# Altium project EMG_TA.PrjPcb
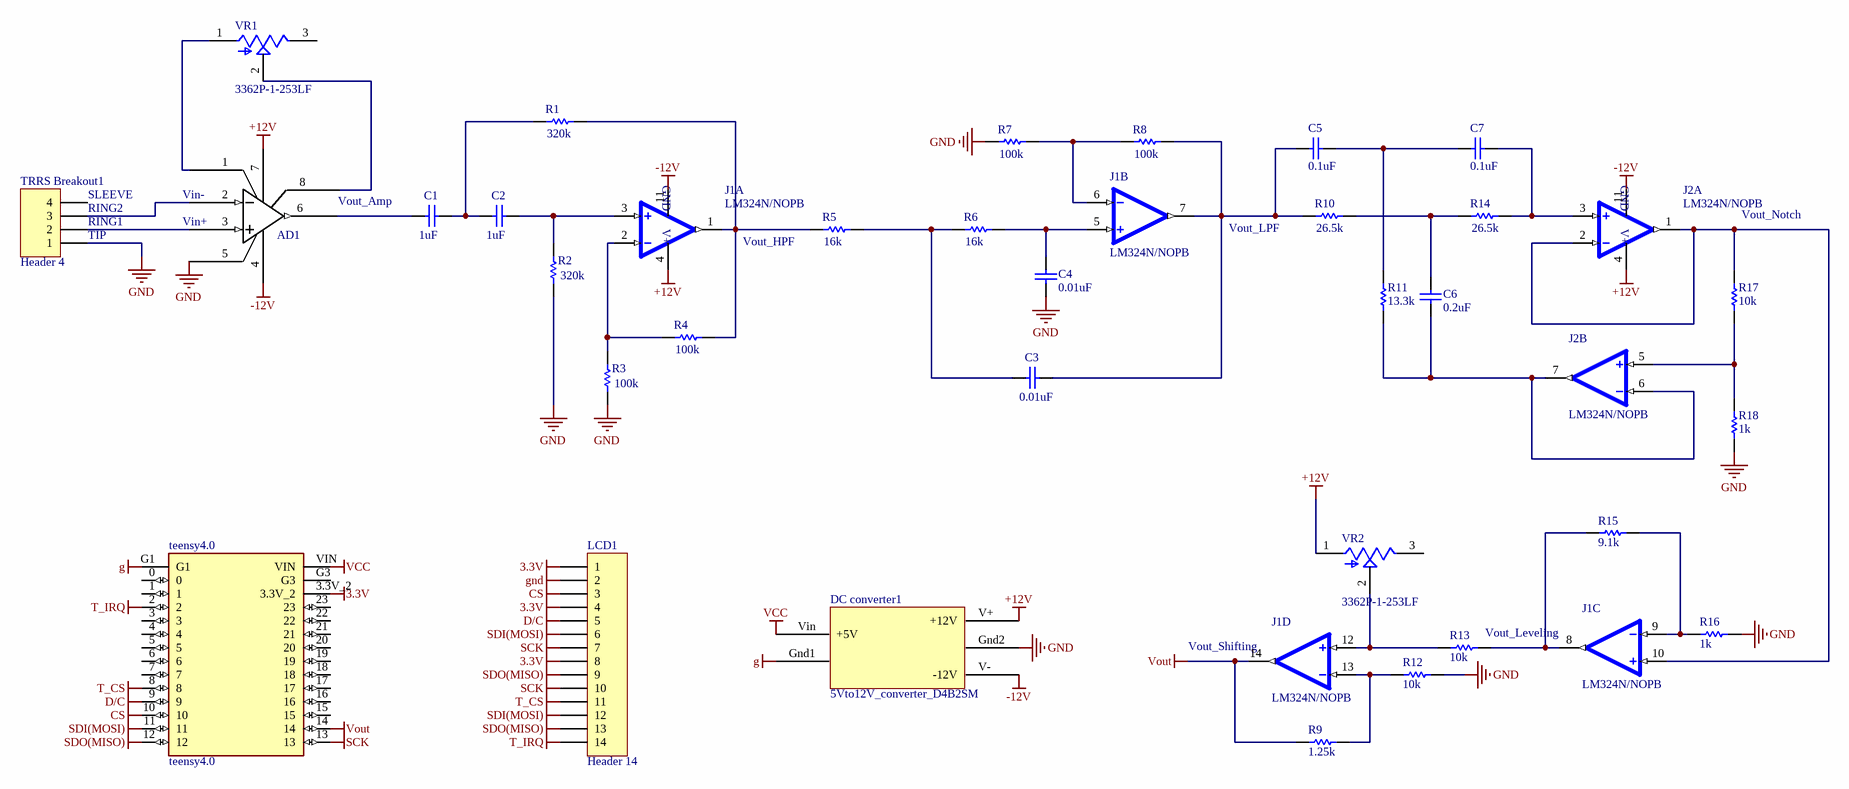
[diagram p0: EMG-circuit_v2.SchDoc]
2 sheets, 73 parts. Net scope: global (net labels, ports and power ports of the same name join across sheets).
Board file: EMG-circuit_v2.PcbDoc
Sheets:
  EMG-circuit_v2.SchDoc
  EMG-circuit.SchDoc

## Sheet EMG-circuit_v2.SchDoc
size A3; SheetNumber: 1; SheetTotal: 1; SPICEModelCacheHVKWMQRZ: <root> / <DocumentId>HVKWMQRZ</DocumentId> / <CacheFrame Number="0"> / <Model Name="cap" Kind="MDL"> / <Text>*Default semiconductor capacitor / .MODEL CAP C()</Text> / </Model> / </CacheFrame> / </root>

### Parts
(Parts that share a designator on the sheet are numbered #1, #2 ... from top to bottom, then left to right.)
AD1#1  [Instrumentation amplifier]8pin-DIP-10.92*7.11  [AD620AN-8pin-10.92*7.11]  (value not drawn)
C1#1  value 1uF  [RAD-0.3]  (hidden comment: Cap)
C2#1  value 1uF  [RAD-0.3]  (hidden comment: Cap)
C3#1  value 0.01uF  [RAD-0.3]  (hidden comment: Cap)
C4#1  value 0.01uF  [RAD-0.3]  (hidden comment: Cap)
C5#1  value 0.1uF  [RAD-0.3]  (hidden comment: Cap)
C6#1  value 0.2uF  [RAD-0.3]  (hidden comment: Cap)
C7#1  value 0.1uF  [RAD-0.3]  (hidden comment: Cap)
DC_converter1  5Vto12V_converter_D4B2SM  [5Vto12V_converter-5pin-24*12.4]
J1  LM324N/NOPB  [DIP825W47P254L1917H533Q14]  (parts A,B,C,D of 4)
J2  LM324N/NOPB  [DIP825W47P254L1917H533Q14]  (parts A,B of 4)
LCD1  Header 14  [HDR1X14]
R1#1  value 320k  [AXIAL-0.3]  (hidden comment: Res1)
R2#1  value 320k  [AXIAL-0.3]  (hidden comment: Res1)
R3#1  value 100k  [AXIAL-0.3]  (hidden comment: Res1)
R4#1  value 100k  [AXIAL-0.3]  (hidden comment: Res1)
R5#1  value 16k  [AXIAL-0.3]  (hidden comment: Res1)
R6#1  value 16k  [AXIAL-0.3]  (hidden comment: Res1)
R7#1  value 100k  [AXIAL-0.3]  (hidden comment: Res1)
R8#1  value 100k  [AXIAL-0.3]  (hidden comment: Res1)
R9#1  value 1.25k  [AXIAL-0.3]  (hidden comment: Res1)
R10#1  value 26.5k  [AXIAL-0.3]  (hidden comment: Res1)
R11#1  value 13.3k  [AXIAL-0.3]  (hidden comment: Res1)
R12#1  value 10k  [AXIAL-0.3]  (hidden comment: Res1)
R13#1  value 10k  [AXIAL-0.3]  (hidden comment: Res1)
R14#1  value 26.5k  [AXIAL-0.3]  (hidden comment: Res1)
R15#1  value 9.1k  [AXIAL-0.3]  (hidden comment: Res1)
R16#1  value 1k  [AXIAL-0.3]  (hidden comment: Res1)
R17#1  value 10k  [AXIAL-0.3]  (hidden comment: Res1)
R18  value 1k  [AXIAL-0.3]  (hidden comment: Res1)
teensy4.0  teensy4.0  [teensy4.0]
TRRS_Breakout1#1  Header 4  [HDR1X4]
VR1#1  3362P-1-253LF  [TRIM_3362P-1-253LF]
VR2#1  3362P-1-253LF  [TRIM_3362P-1-253LF]

### Nets
3.3V: LCD1.1 LCD1.4 LCD1.8 teensy4.0.3.3V_2
+12V: AD1#1.7(+Vs) DC_converter1.V+(+12V) J1.4(V+) J2.4(V+) VR2#1.1(CCW)
-12V: AD1#1.4(-Vs) DC_converter1.V-(-12V) J1.11(GND) J2.11(GND)
CS: LCD1.3 teensy4.0.10
D/C: LCD1.5 teensy4.0.9
g: DC_converter1.Gnd1(gnd1) teensy4.0.G1
GND: AD1#1.5(Ref) C4#1.2 DC_converter1.Gnd2(gnd) LCD1.2 R2#1.1 R3#1.2 R7#1.1 R12#1.1 R16#1.1 R18.1 TRRS_Breakout1#1.1
SCK: LCD1.7 LCD1.10 teensy4.0.13
SDI(MOSI): LCD1.6 LCD1.12 teensy4.0.11
SDO(MISO): LCD1.9 LCD1.13 teensy4.0.12
T_CS: LCD1.11 teensy4.0.8
T_IRQ: LCD1.14 teensy4.0.2
VCC: DC_converter1.Vin(+5V) teensy4.0.VIN
Vout: J1.14(4OUT) R9#1.2 teensy4.0.14
NetAD1#1_1: AD1#1.1(Rg) VR1#1.1(CCW)
NetAD1#1_2: AD1#1.2(Vin-) TRRS_Breakout1#1.3
NetAD1#1_3: AD1#1.3(Vin+) TRRS_Breakout1#1.2
NetAD1#1_6: AD1#1.6(Output) C1#1.1
NetAD1#1_8: AD1#1.8(Rg) VR1#1.2(WIPER)
NetC1#1_2: C1#1.2 C2#1.1 R1#1.2
NetC2#1_2: C2#1.2 J1.3(1IN+) R2#1.2
NetC3#1_1: C3#1.1 R5#1.2 R6#1.1
NetC3#1_2: C3#1.2 C5#1.2 J1.7(2OUT) R8#1.2 R10#1.1
NetC4#1_1: C4#1.1 J1.5(2IN+) R6#1.2
NetC5#1_1: C5#1.1 C7#1.2 R11#1.2
NetC6#1_1: C6#1.1 J2.6(2IN-) J2.7(2OUT) R11#1.1
NetC6#1_2: C6#1.2 R10#1.2 R14#1.1
NetC7#1_1: C7#1.1 J2.3(1IN+) R14#1.2
NetJ1_1: J1.1(1OUT) R1#1.1 R4#1.2 R5#1.1
NetJ1_2: J1.2(1IN-) R3#1.1 R4#1.1
NetJ1_6: J1.6(2IN-) R7#1.2 R8#1.1
NetJ1_8: J1.8(3OUT) R13#1.1 R15#1.2
NetJ1_9: J1.9(3IN-) R15#1.1 R16#1.2
NetJ1_10: J1.10(3IN+) J2.1(1OUT) J2.2(1IN-) R17#1.2
NetJ1_12: J1.12(4IN+) R13#1.2 VR2#1.2(WIPER)
NetJ1_13: J1.13(4IN-) R9#1.1 R12#1.2
NetJ2_5: J2.5(2IN+) R17#1.1 R18.2

Not connected (* = marked no-connect by the designer): teensy4.0 0 1 3 4 5 6 7 15 16 17 18 19 20 21 22 23 G3; TRRS_Breakout1#1 4; VR1#1 3(CW); VR2#1 3(CW)

### Notes on the sheet
- (near TRRS_Breakout1#1) TIP
- (near TRRS_Breakout1#1) RING1
- (near TRRS_Breakout1#1) RING2
- (near TRRS_Breakout1#1) SLEEVE
- (near AD1#1) Vin+
- (near AD1#1) Vin-
- Vout_Amp
- Vout_HPF
- Vout_LPF
- Vout_Notch
- (near J1) Vout_Shifting
- (near R13#1) Vout_Leveling

### Library data of the parts
AD1#1 = OP
C1#1 C2#1 C3#1 C4#1 C5#1 C6#1 C7#1 = Cap: Capacitor; Published: 8-Jun-2000; LatestRevisionDate: 17-Jul-2002; LatestRevisionNote: Re-released for DXP Platform.; PackageReference: RAD-0.3; Publisher: Altium Limited; PackageDescription: Radial Cap, Thru-Hole; 2 Leads; 0.3 in Pin Spacing
DC_converter1 = 5Vto12V_converter_D4B2SM: 5V to +-12V DC converter
LCD1 = Header 14: Header, 14-Pin; LatestRevisionDate: 17-Jul-2002; LatestRevisionNote: Re-released for DXP Platform.; Publisher: Altium Limited
R1#1 R2#1 R3#1 R4#1 R5#1 R6#1 R7#1 R8#1 R9#1 R10#1 R11#1 R12#1 R13#1 R14#1 R15#1 R16#1 R17#1 R18 = Res1: Resistor; Published: 8-Jun-2000; LatestRevisionDate: 17-Jul-2002; LatestRevisionNote: Re-released for DXP Platform.; PackageReference: AXIAL-0.3; Publisher: Altium Limited; PackageDescription: Axial Device, Thru-Hole; 2 Leads; 0.3 in Pin Spacing
TRRS_Breakout1#1 = Header 4: Header, 4-Pin; LatestRevisionDate: 17-Jul-2002; LatestRevisionNote: Re-released for DXP Platform.; Publisher: Altium Limited
VR1#1 VR2#1 = 3362P-1-253LF: 25 kOhms 0.5W, 1/2W PC Pins Through Hole Trimmer Potentiometer Cermet 1 Turn Top Adjustment; MF: Bourns; Check_prices: https://www.snapeda.com/parts/3362P-1-253LF/Bourns/view-part/493663/?ref=eda; SnapEDA_Link: https://www.snapeda.com/parts/3362P-1-253LF/Bourns/view-part/493663/?ref=snap; Availability: Good; Value: *; Purchase-URL: https://pricing.snapeda.com/search/part/3362P-1-253LF/?ref=eda; Price: None; MP: 3362P-1-253LF; Package: 3116 Bourns
J1 J2 = LM324N/NOPB: Price: None; Package: None; Availability: Unavailable; MP: LM324N/NOPB; Value: *

## Sheet EMG-circuit.SchDoc
size A3; SheetNumber: 1; SheetTotal: 1; SPICEModelCacheKQYJZISL: <root> / <DocumentId>KQYJZISL</DocumentId> / <CacheFrame Number="0"> / <Model Name="cap" Kind="MDL"> / <Text>*Default semiconductor capacitor / .MODEL CAP C()</Text> / </Model> / </CacheFrame> / </root>
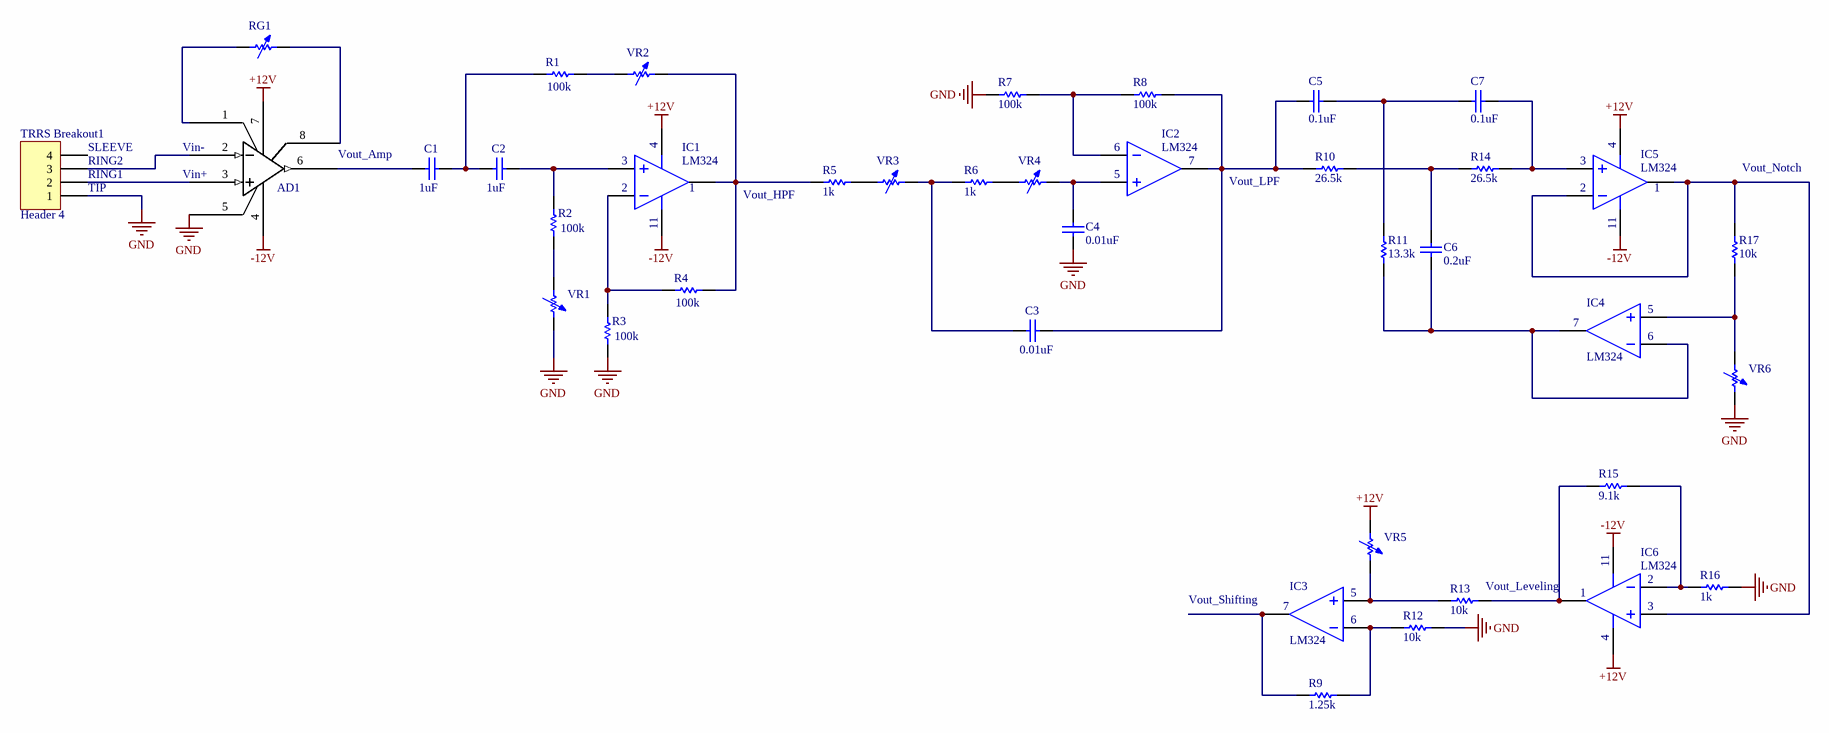
[diagram p1: EMG-circuit.SchDoc]

### Parts
(Parts that share a designator on the sheet are numbered #1, #2 ... from top to bottom, then left to right.)
AD1#2  [Instrumentation amplifier]8pin-DIP-10.92*7.11  [AD620AN-8pin-10.92*7.11]  (value not drawn)
C1#2  value 1uF  [RAD-0.3]  (hidden comment: Cap)
C2#2  value 1uF  [RAD-0.3]  (hidden comment: Cap)
C3#2  value 0.01uF  [RAD-0.3]  (hidden comment: Cap)
C4#2  value 0.01uF  [RAD-0.3]  (hidden comment: Cap)
C5#2  value 0.1uF  [RAD-0.3]  (hidden comment: Cap)
C6#2  value 0.2uF  [RAD-0.3]  (hidden comment: Cap)
C7#2  value 0.1uF  [RAD-0.3]  (hidden comment: Cap)
IC1  LM324
IC2  LM324
IC3  LM324
IC4  LM324
IC5  LM324
IC6  LM324
R1#2  value 100k  [AXIAL-0.3]  (hidden comment: Res1)
R2#2  value 100k  [AXIAL-0.3]  (hidden comment: Res1)
R3#2  value 100k  [AXIAL-0.3]  (hidden comment: Res1)
R4#2  value 100k  [AXIAL-0.3]  (hidden comment: Res1)
R5#2  value 1k  (hidden comment: Resistor)
R6#2  value 1k  (hidden comment: Resistor)
R7#2  value 100k  (hidden comment: Resistor)
R8#2  value 100k  (hidden comment: Resistor)
R9#2  value 1.25k  (hidden comment: Resistor)
R10#2  value 26.5k  (hidden comment: Resistor)
R11#2  value 13.3k  (hidden comment: Resistor)
R12#2  value 10k  (hidden comment: Resistor)
R13#2  value 10k  (hidden comment: Resistor)
R14#2  value 26.5k  (hidden comment: Resistor)
R15#2  value 9.1k  (hidden comment: Resistor)
R16#2  value 1k  (hidden comment: Resistor)
R17#2  value 10k  (hidden comment: Resistor)
RG1  Res Adj1  [AXIAL-0.7]  (value not drawn)
TRRS_Breakout1#2  Header 4  [HDR1X4]
VR1#2  Res Adj1  [AXIAL-0.7]  (value not drawn)
VR2#2  Res Adj1  [AXIAL-0.7]  (value not drawn)
VR3  Res Adj1  [AXIAL-0.7]  (value not drawn)
VR4  Res Adj1  [AXIAL-0.7]  (value not drawn)
VR5  Res Adj1  [AXIAL-0.7]  (value not drawn)
VR6  Res Adj1  [AXIAL-0.7]  (value not drawn)

### Nets
+12V: AD1#2.7(+Vs) IC1.5(V-) IC5.5(V-) IC6.5(V-) VR5.1
-12V: AD1#2.4(-Vs) IC1.4(V+) IC5.4(V+) IC6.4(V+)
GND: AD1#2.5(Ref) C4#2.2 R3#2.2 R7#2.1 R12#2.1 R16#2.1 TRRS_Breakout1#2.1 VR1#2.2 VR6.2
NetAD1#2_1: AD1#2.1(Rg) RG1.1
NetAD1#2_2: AD1#2.2(Vin-) TRRS_Breakout1#2.3
NetAD1#2_3: AD1#2.3(Vin+) TRRS_Breakout1#2.2
NetAD1#2_6: AD1#2.6(Output) C1#2.1
NetAD1#2_8: AD1#2.8(Rg) RG1.2
NetC1#2_2: C1#2.2 C2#2.1 R1#2.2
NetC2#2_2: C2#2.2 IC1.2(IN+) R2#2.2
NetC3#2_1: C3#2.1 R6#2.1 VR3.2
NetC3#2_2: C3#2.2 C5#2.2 IC2.3(OUT) R8#2.2 R10#2.1
NetC4#2_1: C4#2.1 IC2.2(IN+) VR4.2
NetC5#2_1: C5#2.1 C7#2.2 R11#2.1
NetC6#2_1: C6#2.1 IC4.1(IN-) IC4.3(OUT) R11#2.2
NetC6#2_2: C6#2.2 R10#2.2 R14#2.1
NetC7#2_1: C7#2.1 IC5.2(IN+) R14#2.2
NetIC1_1: IC1.1(IN-) R3#2.1 R4#2.1
NetIC1_3: IC1.3(OUT) R4#2.2 R5#2.1 VR2#2.2
NetIC2_1: IC2.1(IN-) R7#2.2 R8#2.1
NetIC3_1: IC3.1(IN-) R9#2.1 R12#2.2
NetIC3_2: IC3.2(IN+) R13#2.2 VR5.2
NetIC3_3: IC3.3(OUT) R9#2.2
NetIC4_2: IC4.2(IN+) R17#2.2 VR6.1
NetIC5_1: IC5.1(IN-) IC5.3(OUT) IC6.2(IN+) R17#2.1
NetIC6_1: IC6.1(IN-) R15#2.1 R16#2.2
NetIC6_3: IC6.3(OUT) R13#2.1 R15#2.2
NetR1#2_1: R1#2.1 VR2#2.1
NetR2#2_1: R2#2.1 VR1#2.1
NetR5#2_2: R5#2.2 VR3.1
NetR6#2_2: R6#2.2 VR4.1

Not connected (* = marked no-connect by the designer): TRRS_Breakout1#2 4

### Notes on the sheet
- (near TRRS_Breakout1#2) RING2
- (near TRRS_Breakout1#2) SLEEVE
- (near AD1#2) Vin-
- Vout_Amp
- (near IC1) 3
- (near IC1) 4
- (near IC2) 6
- (near IC2) 7
- (near IC5) 3
- (near IC5) 4
- (near TRRS_Breakout1#2) TIP
- (near TRRS_Breakout1#2) RING1
- (near AD1#2) Vin+
- (near IC1) 2
- (near IC1) 11
- (near IC1) 1
- (near R5#2) Vout_HPF
- (near IC2) 5
- Vout_LPF
- (near IC5) 2
- (near IC5) 11
- (near IC5) 1
- Vout_Notch
- (near IC4) 7
- (near IC4) 5
- (near IC4) 6
- (near IC6) 11
- (near IC3) Vout_Shifting
- (near IC3) 7
- (near IC3) 5
- (near IC3) 6
- (near R13#2) Vout_Leveling
- (near IC6) 1
- (near IC6) 4
- (near IC6) 2
- (near IC6) 3

### Library data of the parts
AD1#2 = OP
C1#2 C2#2 C3#2 C4#2 C5#2 C6#2 C7#2 = Cap: Capacitor; Published: 8-Jun-2000; LatestRevisionDate: 17-Jul-2002; LatestRevisionNote: Re-released for DXP Platform.; PackageReference: RAD-0.3; Publisher: Altium Limited; PackageDescription: Radial Cap, Thru-Hole; 2 Leads; 0.3 in Pin Spacing
IC1 IC5 IC6 = OpAmp with power terminals: Ideal Operational Amplifier; SimulationGenericComponent: True; GAIN: 1Meg
IC2-IC4 = OpAmp: Ideal Operational Amplifier; SimulationGenericComponent: True; GAIN: 1Meg
R1#2 R2#2 R3#2 R4#2 = Res1: Resistor; Published: 8-Jun-2000; LatestRevisionDate: 17-Jul-2002; LatestRevisionNote: Re-released for DXP Platform.; PackageReference: AXIAL-0.3; Publisher: Altium Limited; PackageDescription: Axial Device, Thru-Hole; 2 Leads; 0.3 in Pin Spacing
R5#2 R6#2 R7#2 R8#2 R9#2 R10#2 R11#2 R12#2 R13#2 R14#2 R15#2 R16#2 R17#2 = Resistor: TC1: 0; SimulationGenericComponent: True; TC2: 0
RG1 = Res Adj1: Variable Resistor; Value: 1k; Set Position: 0.5; Published: 8-Jun-2000; LatestRevisionDate: 17-Jul-2002; LatestRevisionNote: Re-released for DXP Platform.; PackageReference: AXIAL-0.7; Publisher: Altium Limited; PackageDescription: Axial Device, Thru-Hole; 2 Leads; 0.7 in Pin Spacing
TRRS_Breakout1#2 = Header 4: Header, 4-Pin; LatestRevisionDate: 17-Jul-2002; LatestRevisionNote: Re-released for DXP Platform.; Publisher: Altium Limited
VR1#2 VR2#2 = Res Adj1: Variable Resistor; Value: 500k; Set Position: 0.5; Published: 8-Jun-2000; LatestRevisionDate: 17-Jul-2002; LatestRevisionNote: Re-released for DXP Platform.; PackageReference: AXIAL-0.7; Publisher: Altium Limited; PackageDescription: Axial Device, Thru-Hole; 2 Leads; 0.7 in Pin Spacing
VR3-VR6 = Res Adj1: Variable Resistor; Value: 100k; Set Position: 0.5; Published: 8-Jun-2000; LatestRevisionDate: 17-Jul-2002; LatestRevisionNote: Re-released for DXP Platform.; PackageReference: AXIAL-0.7; Publisher: Altium Limited; PackageDescription: Axial Device, Thru-Hole; 2 Leads; 0.7 in Pin Spacing

## Nets that join several sheets
+12V: EMG-circuit_v2 (5 pins), EMG-circuit (5 pins)
-12V: EMG-circuit_v2 (AD1#1.4 DC_converter1.V- J1.11 J2.11), EMG-circuit (AD1#2.4 IC1.4 IC5.4 IC6.4)
GND: EMG-circuit_v2 (11 pins), EMG-circuit (9 pins)